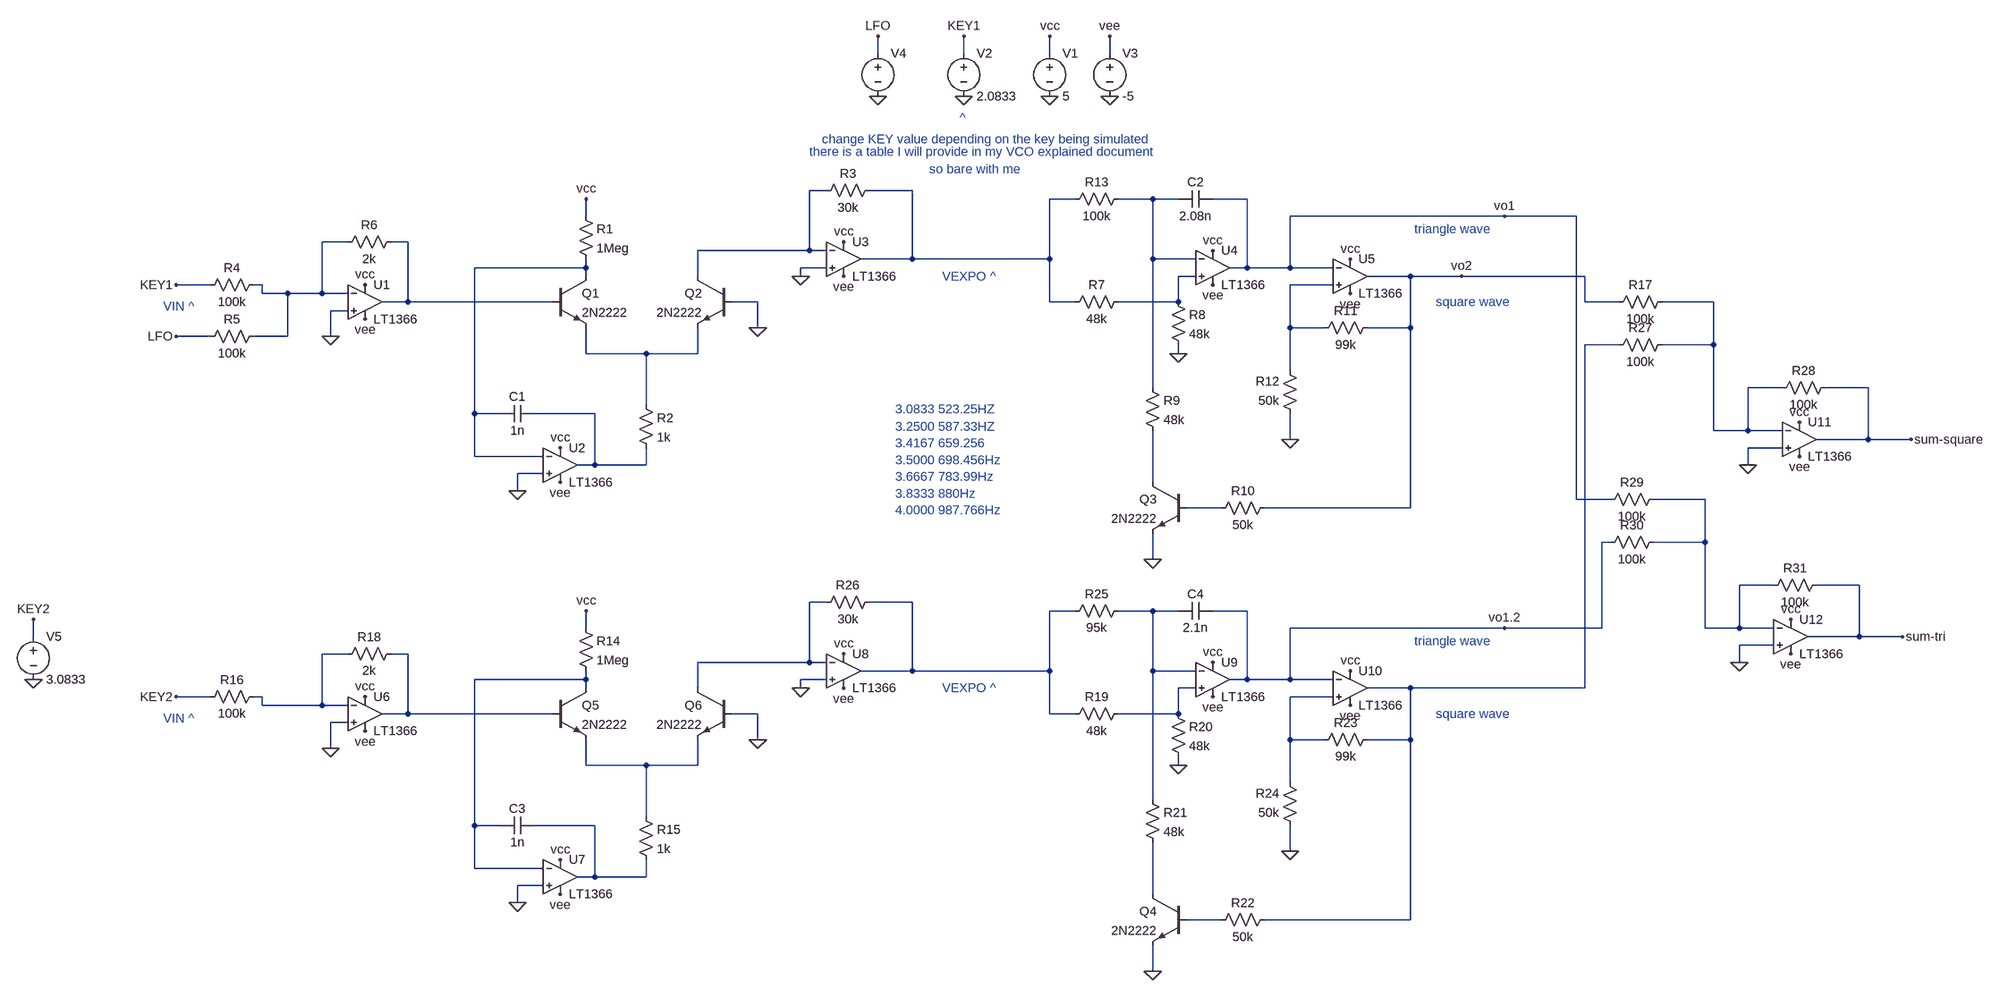
[diagram p0: schematic 2VCOs.asc]
2VCOs.asc, the LTspice schematic file:
Version 4
SHEET 1 4024 1300
WIRE 736 -432 736 -464
WIRE 896 -432 896 -464
WIRE 1056 -432 1056 -464
WIRE 1168 -432 1168 -464
WIRE 640 -176 608 -176
WIRE 800 -176 720 -176
WIRE 1104 -160 1056 -160
WIRE 1248 -160 1184 -160
WIRE 1296 -160 1248 -160
WIRE 1424 -160 1360 -160
WIRE 192 -128 192 -160
WIRE 1904 -128 1504 -128
WIRE 2064 -128 1904 -128
WIRE -352 -80 -400 -80
WIRE -240 -80 -272 -80
WIRE 608 -64 608 -176
WIRE 608 -64 400 -64
WIRE 640 -64 608 -64
WIRE 800 -48 800 -176
WIRE 800 -48 704 -48
WIRE 1056 -48 1056 -160
WIRE 1056 -48 800 -48
WIRE 1248 -48 1248 -160
WIRE 1328 -48 1248 -48
WIRE 192 -32 192 -48
WIRE 192 -32 -16 -32
WIRE 640 -32 592 -32
WIRE 1424 -32 1424 -160
WIRE 1424 -32 1392 -32
WIRE 1504 -32 1504 -128
WIRE 1504 -32 1424 -32
WIRE 1584 -32 1504 -32
WIRE 192 -16 192 -32
WIRE 400 -16 400 -64
WIRE 592 -16 592 -32
WIRE 1328 -16 1296 -16
WIRE 1728 -16 1648 -16
WIRE 1824 -16 1728 -16
WIRE 2080 -16 1824 -16
WIRE -608 0 -672 0
WIRE -512 0 -528 0
WIRE 1584 0 1504 0
WIRE -512 16 -512 0
WIRE -464 16 -512 16
WIRE -400 16 -400 -80
WIRE -400 16 -464 16
WIRE -352 16 -400 16
WIRE -240 32 -240 -80
WIRE -240 32 -288 32
WIRE 128 32 -240 32
WIRE 512 32 464 32
WIRE 1056 32 1056 -48
WIRE 1104 32 1056 32
WIRE 1296 32 1296 -16
WIRE 1296 32 1184 32
WIRE 2080 32 2080 -16
WIRE 2144 32 2080 32
WIRE 2320 32 2224 32
WIRE -352 48 -384 48
WIRE 512 80 512 32
WIRE 1504 80 1504 0
WIRE 1568 80 1504 80
WIRE 1728 80 1728 -16
WIRE 1728 80 1648 80
WIRE -608 96 -672 96
WIRE -464 96 -464 16
WIRE -464 96 -528 96
WIRE -384 96 -384 48
WIRE 2144 112 2080 112
WIRE 2320 112 2320 32
WIRE 2320 112 2224 112
WIRE 192 128 192 80
WIRE 304 128 192 128
WIRE 400 128 400 80
WIRE 400 128 304 128
WIRE 1296 128 1296 112
WIRE 1504 160 1504 80
WIRE 1248 192 1248 -48
WIRE 2448 192 2384 192
WIRE 2608 192 2528 192
WIRE 304 224 304 128
WIRE -16 240 -16 -32
WIRE 32 240 -16 240
WIRE 208 240 96 240
WIRE 2320 272 2320 112
WIRE 2384 272 2384 192
WIRE 2384 272 2320 272
WIRE 2448 272 2384 272
WIRE 1504 288 1504 240
WIRE 2608 288 2608 192
WIRE 2608 288 2512 288
WIRE 2688 288 2608 288
WIRE 2448 304 2384 304
WIRE -16 320 -16 240
WIRE 112 320 -16 320
WIRE 208 336 208 240
WIRE 208 336 176 336
WIRE 304 336 304 304
WIRE 304 336 208 336
WIRE 2384 336 2384 304
WIRE 112 352 64 352
WIRE 1248 368 1248 272
WIRE 64 384 64 352
WIRE 2064 400 2064 -128
WIRE 2128 400 2064 400
WIRE 2304 400 2208 400
WIRE 1376 416 1312 416
WIRE 1728 416 1728 80
WIRE 1728 416 1456 416
WIRE 2128 480 2112 480
WIRE 2304 480 2304 400
WIRE 2304 480 2208 480
WIRE 1248 512 1248 464
WIRE 2432 560 2368 560
WIRE 2592 560 2512 560
WIRE 640 592 608 592
WIRE 800 592 720 592
WIRE 1104 608 1056 608
WIRE 1248 608 1184 608
WIRE 1296 608 1248 608
WIRE 1424 608 1360 608
WIRE 192 640 192 608
WIRE 1904 640 1504 640
WIRE 2112 640 2112 480
WIRE 2112 640 1904 640
WIRE 2304 640 2304 480
WIRE 2368 640 2368 560
WIRE 2368 640 2304 640
WIRE 2432 640 2368 640
WIRE -1008 656 -1008 624
WIRE 2592 656 2592 560
WIRE 2592 656 2496 656
WIRE 2672 656 2592 656
WIRE 2432 672 2368 672
WIRE -352 688 -400 688
WIRE -240 688 -272 688
WIRE 608 704 608 592
WIRE 608 704 400 704
WIRE 640 704 608 704
WIRE 2368 704 2368 672
WIRE 800 720 800 592
WIRE 800 720 704 720
WIRE 1056 720 1056 608
WIRE 1056 720 800 720
WIRE 1248 720 1248 608
WIRE 1328 720 1248 720
WIRE 192 736 192 720
WIRE 192 736 -16 736
WIRE 640 736 592 736
WIRE 1424 736 1424 608
WIRE 1424 736 1392 736
WIRE 1504 736 1504 640
WIRE 1504 736 1424 736
WIRE 1584 736 1504 736
WIRE 192 752 192 736
WIRE 400 752 400 704
WIRE 592 752 592 736
WIRE 1328 752 1296 752
WIRE 1728 752 1648 752
WIRE 2080 752 2080 112
WIRE 2080 752 1728 752
WIRE -608 768 -672 768
WIRE -512 768 -528 768
WIRE 1584 768 1504 768
WIRE -512 784 -512 768
WIRE -400 784 -400 688
WIRE -400 784 -512 784
WIRE -352 784 -400 784
WIRE -240 800 -240 688
WIRE -240 800 -288 800
WIRE 128 800 -240 800
WIRE 512 800 464 800
WIRE 1056 800 1056 720
WIRE 1104 800 1056 800
WIRE 1296 800 1296 752
WIRE 1296 800 1184 800
WIRE -352 816 -384 816
WIRE 512 848 512 800
WIRE 1504 848 1504 768
WIRE 1568 848 1504 848
WIRE 1728 848 1728 752
WIRE 1728 848 1648 848
WIRE -384 864 -384 816
WIRE 192 896 192 848
WIRE 304 896 192 896
WIRE 400 896 400 848
WIRE 400 896 304 896
WIRE 1296 896 1296 880
WIRE 1504 928 1504 848
WIRE 1248 960 1248 720
WIRE 304 992 304 896
WIRE -16 1008 -16 736
WIRE 32 1008 -16 1008
WIRE 208 1008 96 1008
WIRE 1504 1056 1504 1008
WIRE -16 1088 -16 1008
WIRE 112 1088 -16 1088
WIRE 208 1104 208 1008
WIRE 208 1104 176 1104
WIRE 304 1104 304 1072
WIRE 304 1104 208 1104
WIRE 112 1120 64 1120
WIRE 1248 1136 1248 1040
WIRE 64 1152 64 1120
WIRE 1376 1184 1312 1184
WIRE 1728 1184 1728 848
WIRE 1728 1184 1456 1184
WIRE 1248 1280 1248 1232
FLAG 512 80 0
FLAG 192 -160 vcc
FLAG 64 384 0
FLAG 592 -16 0
FLAG 672 -80 vcc
FLAG 1056 -352 0
FLAG 1056 -464 vcc
FLAG 896 -352 0
FLAG 896 -464 KEY1
FLAG 1168 -352 0
FLAG 1168 -464 vee
FLAG 672 -16 vee
FLAG 144 304 vcc
FLAG 144 368 vee
FLAG -320 0 vcc
FLAG -384 96 0
FLAG -672 0 KEY1
FLAG -672 96 LFO
FLAG 736 -352 0
FLAG 736 -464 LFO
FLAG 1360 -64 vcc
FLAG 1616 -48 vcc
FLAG 1904 -128 vo1
FLAG 1296 128 0
FLAG 1248 512 0
FLAG 1504 288 0
FLAG 1616 16 vee
FLAG 1360 0 vee
FLAG -320 64 vee
FLAG 512 848 0
FLAG 192 608 vcc
FLAG 64 1152 0
FLAG 592 752 0
FLAG 672 688 vcc
FLAG 672 752 vee
FLAG 144 1072 vcc
FLAG 144 1136 vee
FLAG -320 768 vcc
FLAG -384 864 0
FLAG -672 768 KEY2
FLAG 1360 704 vcc
FLAG 1616 720 vcc
FLAG 1904 640 vo1.2
FLAG 1296 896 0
FLAG 1248 1280 0
FLAG 1504 1056 0
FLAG 1616 784 vee
FLAG 1360 768 vee
FLAG -320 832 vee
FLAG -1008 624 KEY2
FLAG 2384 336 0
FLAG 2480 256 vcc
FLAG 2480 320 vee
FLAG 2688 288 sum-square
FLAG 2368 704 0
FLAG 2464 624 vcc
FLAG 2464 688 vee
FLAG 2672 656 sum-tri
FLAG 1824 -16 vo2
FLAG -1008 736 0
SYMBOL res 176 -144 R0
SYMATTR InstName R1
SYMATTR Value 1Meg
SYMBOL cap 96 224 R90
WINDOW 0 0 32 VBottom 2
WINDOW 3 32 32 VTop 2
SYMATTR InstName C1
SYMATTR Value 1n
SYMBOL res 288 208 R0
SYMATTR InstName R2
SYMATTR Value 1k
SYMBOL res 736 -192 R90
WINDOW 0 0 56 VBottom 2
WINDOW 3 32 56 VTop 2
SYMATTR InstName R3
SYMATTR Value 30k
SYMBOL voltage 1056 -448 R0
SYMATTR InstName V1
SYMATTR Value 5
SYMBOL voltage 896 -448 R0
WINDOW 123 0 0 Left 0
WINDOW 39 0 0 Left 0
SYMATTR InstName V2
SYMATTR Value 2.0833
SYMBOL voltage 1168 -448 R0
SYMATTR InstName V3
SYMATTR Value -5
SYMBOL res -512 -16 R90
WINDOW 0 0 56 VBottom 2
WINDOW 3 32 56 VTop 2
SYMATTR InstName R4
SYMATTR Value 100k
SYMBOL res -512 80 R90
WINDOW 0 0 56 VBottom 2
WINDOW 3 32 56 VTop 2
SYMATTR InstName R5
SYMATTR Value 100k
SYMBOL res -256 -96 R90
WINDOW 0 0 56 VBottom 2
WINDOW 3 32 56 VTop 2
SYMATTR InstName R6
SYMATTR Value 2k
SYMBOL voltage 736 -448 R0
WINDOW 123 0 0 Left 0
WINDOW 39 0 0 Left 0
SYMATTR InstName V4
SYMATTR Value ""
SYMBOL cap 1360 -176 R90
WINDOW 0 0 32 VBottom 2
WINDOW 3 32 32 VTop 2
SYMATTR InstName C2
SYMATTR Value 2.08n
SYMBOL res 1200 16 R90
WINDOW 0 0 56 VBottom 2
WINDOW 3 32 56 VTop 2
SYMATTR InstName R7
SYMATTR Value 48k
SYMBOL res 1280 16 R0
SYMATTR InstName R8
SYMATTR Value 48k
SYMBOL res 1232 176 R0
SYMATTR InstName R9
SYMATTR Value 48k
SYMBOL npn 1312 368 M0
SYMATTR InstName Q3
SYMATTR Value 2N2222
SYMBOL res 1472 400 R90
WINDOW 0 0 56 VBottom 2
WINDOW 3 32 56 VTop 2
SYMATTR InstName R10
SYMATTR Value 50k
SYMBOL res 1664 64 R90
WINDOW 0 0 56 VBottom 2
WINDOW 3 32 56 VTop 2
SYMATTR InstName R11
SYMATTR Value 99k
SYMBOL res 1520 256 R180
WINDOW 0 36 76 Left 2
WINDOW 3 36 40 Left 2
SYMATTR InstName R12
SYMATTR Value 50k
SYMBOL res 1200 -176 R90
WINDOW 0 0 56 VBottom 2
WINDOW 3 32 56 VTop 2
SYMATTR InstName R13
SYMATTR Value 100k
SYMBOL npn 128 -16 R0
SYMATTR InstName Q1
SYMATTR Value 2N2222
SYMBOL npn 464 -16 M0
SYMATTR InstName Q2
SYMATTR Value 2N2222
SYMBOL Opamps\\LT1366 -320 -32 R0
SYMATTR InstName U1
SYMBOL Opamps\\LT1366 144 272 R0
SYMATTR InstName U2
SYMBOL Opamps\\LT1366 672 -112 R0
SYMATTR InstName U3
SYMBOL Opamps\\LT1366 1360 -96 R0
SYMATTR InstName U4
SYMBOL Opamps\\LT1366 1616 -80 R0
SYMATTR InstName U5
SYMBOL res 176 624 R0
SYMATTR InstName R14
SYMATTR Value 1Meg
SYMBOL cap 96 992 R90
WINDOW 0 0 32 VBottom 2
WINDOW 3 32 32 VTop 2
SYMATTR InstName C3
SYMATTR Value 1n
SYMBOL res 288 976 R0
SYMATTR InstName R15
SYMATTR Value 1k
SYMBOL res -512 752 R90
WINDOW 0 0 56 VBottom 2
WINDOW 3 32 56 VTop 2
SYMATTR InstName R16
SYMATTR Value 100k
SYMBOL res -256 672 R90
WINDOW 0 0 56 VBottom 2
WINDOW 3 32 56 VTop 2
SYMATTR InstName R18
SYMATTR Value 2k
SYMBOL cap 1360 592 R90
WINDOW 0 0 32 VBottom 2
WINDOW 3 32 32 VTop 2
SYMATTR InstName C4
SYMATTR Value 2.1n
SYMBOL res 1200 784 R90
WINDOW 0 0 56 VBottom 2
WINDOW 3 32 56 VTop 2
SYMATTR InstName R19
SYMATTR Value 48k
SYMBOL res 1280 784 R0
SYMATTR InstName R20
SYMATTR Value 48k
SYMBOL res 1232 944 R0
SYMATTR InstName R21
SYMATTR Value 48k
SYMBOL npn 1312 1136 M0
SYMATTR InstName Q4
SYMATTR Value 2N2222
SYMBOL res 1472 1168 R90
WINDOW 0 0 56 VBottom 2
WINDOW 3 32 56 VTop 2
SYMATTR InstName R22
SYMATTR Value 50k
SYMBOL res 1664 832 R90
WINDOW 0 0 56 VBottom 2
WINDOW 3 32 56 VTop 2
SYMATTR InstName R23
SYMATTR Value 99k
SYMBOL res 1520 1024 R180
WINDOW 0 36 76 Left 2
WINDOW 3 36 40 Left 2
SYMATTR InstName R24
SYMATTR Value 50k
SYMBOL res 1200 592 R90
WINDOW 0 0 56 VBottom 2
WINDOW 3 32 56 VTop 2
SYMATTR InstName R25
SYMATTR Value 95k
SYMBOL npn 128 752 R0
SYMATTR InstName Q5
SYMATTR Value 2N2222
SYMBOL npn 464 752 M0
SYMATTR InstName Q6
SYMATTR Value 2N2222
SYMBOL Opamps\\LT1366 -320 736 R0
SYMATTR InstName U6
SYMBOL Opamps\\LT1366 144 1040 R0
SYMATTR InstName U7
SYMBOL Opamps\\LT1366 672 656 R0
SYMATTR InstName U8
SYMBOL Opamps\\LT1366 1360 672 R0
SYMATTR InstName U9
SYMBOL Opamps\\LT1366 1616 688 R0
SYMATTR InstName U10
SYMBOL res 736 576 R90
WINDOW 0 0 56 VBottom 2
WINDOW 3 32 56 VTop 2
SYMATTR InstName R26
SYMATTR Value 30k
SYMBOL voltage -1008 640 R0
WINDOW 123 0 0 Left 0
WINDOW 39 0 0 Left 0
SYMATTR InstName V5
SYMATTR Value 3.0833
SYMBOL Opamps\\LT1366 2480 224 R0
SYMATTR InstName U11
SYMBOL res 2240 16 R90
WINDOW 0 0 56 VBottom 2
WINDOW 3 32 56 VTop 2
SYMATTR InstName R17
SYMATTR Value 100k
SYMBOL res 2240 96 R90
WINDOW 0 0 56 VBottom 2
WINDOW 3 32 56 VTop 2
SYMATTR InstName R27
SYMATTR Value 100k
SYMBOL res 2544 176 R90
WINDOW 0 0 56 VBottom 2
WINDOW 3 32 56 VTop 2
SYMATTR InstName R28
SYMATTR Value 100k
SYMBOL Opamps\\LT1366 2464 592 R0
SYMATTR InstName U12
SYMBOL res 2224 384 R90
WINDOW 0 0 56 VBottom 2
WINDOW 3 32 56 VTop 2
SYMATTR InstName R29
SYMATTR Value 100k
SYMBOL res 2224 464 R90
WINDOW 0 0 56 VBottom 2
WINDOW 3 32 56 VTop 2
SYMATTR InstName R30
SYMATTR Value 100k
SYMBOL res 2528 544 R90
WINDOW 0 0 56 VBottom 2
WINDOW 3 32 56 VTop 2
SYMATTR InstName R31
SYMATTR Value 100k
TEXT 856 -16 Left 2 ;VEXPO ^
TEXT -696 40 Left 2 ;VIN ^
TEXT 1776 32 Left 2 ;square wave
TEXT 1736 -104 Left 2 ;triangle wave
TEXT 632 -272 Left 2 ;change KEY value depending on the key being simulated
TEXT 888 -312 Left 2 ;^
TEXT 608 -248 Left 2 ;there is a table I will provide in my VCO explained document
TEXT 832 -216 Left 2 ;so bare with me
TEXT 856 752 Left 2 ;VEXPO ^
TEXT -696 808 Left 2 ;VIN ^
TEXT 1776 800 Left 2 ;square wave
TEXT 1736 664 Left 2 ;triangle wave
TEXT 768 232 Left 2 ;3.0833 523.25HZ
TEXT 768 264 Left 2 ;3.2500 587.33HZ\n3.4167 659.256\n3.5000 698.456Hz\n3.6667 783.99Hz\n3.8333 880Hz\n4.0000 987.766Hz

The netlist it stands for:
* 2VCOs.asc
R1 vcc N006 1Meg
C1 N012 N006 1n
R2 N011 N012 1k
R3 N002 N001 30k
V1 vcc 0 5
V2 KEY1 0 2.0833
V3 vee 0 -5
R4 N004 KEY1 100k
R5 N004 LFO 100k
R6 N005 N004 2k
V4 LFO 0
C2 vo1 N003 2.08n
R7 N007 N002 48k
R8 N007 0 48k
R9 N003 N013 48k
Q3 N013 N015 0 0 2N2222
R10 vo2 N015 50k
R11 vo2 N008 99k
R12 0 N008 50k
R13 N003 N002 100k
Q1 N006 N005 N011 0 2N2222
Q2 N001 0 N011 0 2N2222
XU1 0 N004 vcc vee N005 LT1366  ; pins In+ In- V+ V- OUT
XU2 0 N006 vcc vee N012 LT1366  ; pins In+ In- V+ V- OUT
XU3 0 N001 vcc vee N002 LT1366  ; pins In+ In- V+ V- OUT
XU4 N007 N003 vcc vee vo1 LT1366  ; pins In+ In- V+ V- OUT
XU5 N008 vo1 vcc vee vo2 LT1366  ; pins In+ In- V+ V- OUT
R14 vcc N021 1Meg
C3 N025 N021 1n
R15 N024 N025 1k
R16 N019 KEY2 100k
R18 N020 N019 2k
C4 vo1.2 N018 2.1n
R19 N022 N017 48k
R20 N022 0 48k
R21 N018 N026 48k
Q4 N026 N027 0 0 2N2222
R22 N010 N027 50k
R23 N010 N023 99k
R24 0 N023 50k
R25 N018 N017 95k
Q5 N021 N020 N024 0 2N2222
Q6 N016 0 N024 0 2N2222
XU6 0 N019 vcc vee N020 LT1366  ; pins In+ In- V+ V- OUT
XU7 0 N021 vcc vee N025 LT1366  ; pins In+ In- V+ V- OUT
XU8 0 N016 vcc vee N017 LT1366  ; pins In+ In- V+ V- OUT
XU9 N022 N018 vcc vee vo1.2 LT1366  ; pins In+ In- V+ V- OUT
XU10 N023 vo1.2 vcc vee N010 LT1366  ; pins In+ In- V+ V- OUT
R26 N017 N016 30k
V5 KEY2 0 3.0833
XU11 0 N009 vcc vee sum-square LT1366  ; pins In+ In- V+ V- OUT
R17 N009 vo2 100k
R27 N009 N010 100k
R28 sum-square N009 100k
XU12 0 N014 vcc vee sum-tri LT1366  ; pins In+ In- V+ V- OUT
R29 N014 vo1 100k
R30 N014 vo1.2 100k
R31 sum-tri N014 100k
.model NPN NPN
.model PNP PNP
.lib standard.bjt
* VEXPO ^
* VIN ^
* square wave
* triangle wave
* change KEY value depending on the key being simulated
* ^
* there is a table I will provide in my VCO explained document
* so bare with me
* VEXPO ^
* VIN ^
* square wave
* triangle wave
* 3.0833 523.25HZ
* 3.2500 587.33HZ
* 3.4167 659.256
* 3.5000 698.456Hz
* 3.6667 783.99Hz
* 3.8333 880Hz
* 4.0000 987.766Hz
.lib LTC.lib
.backanno
.end